# EAGLE design ocmod_module_playground_smt_v1 (EAGLE 7.3.0)
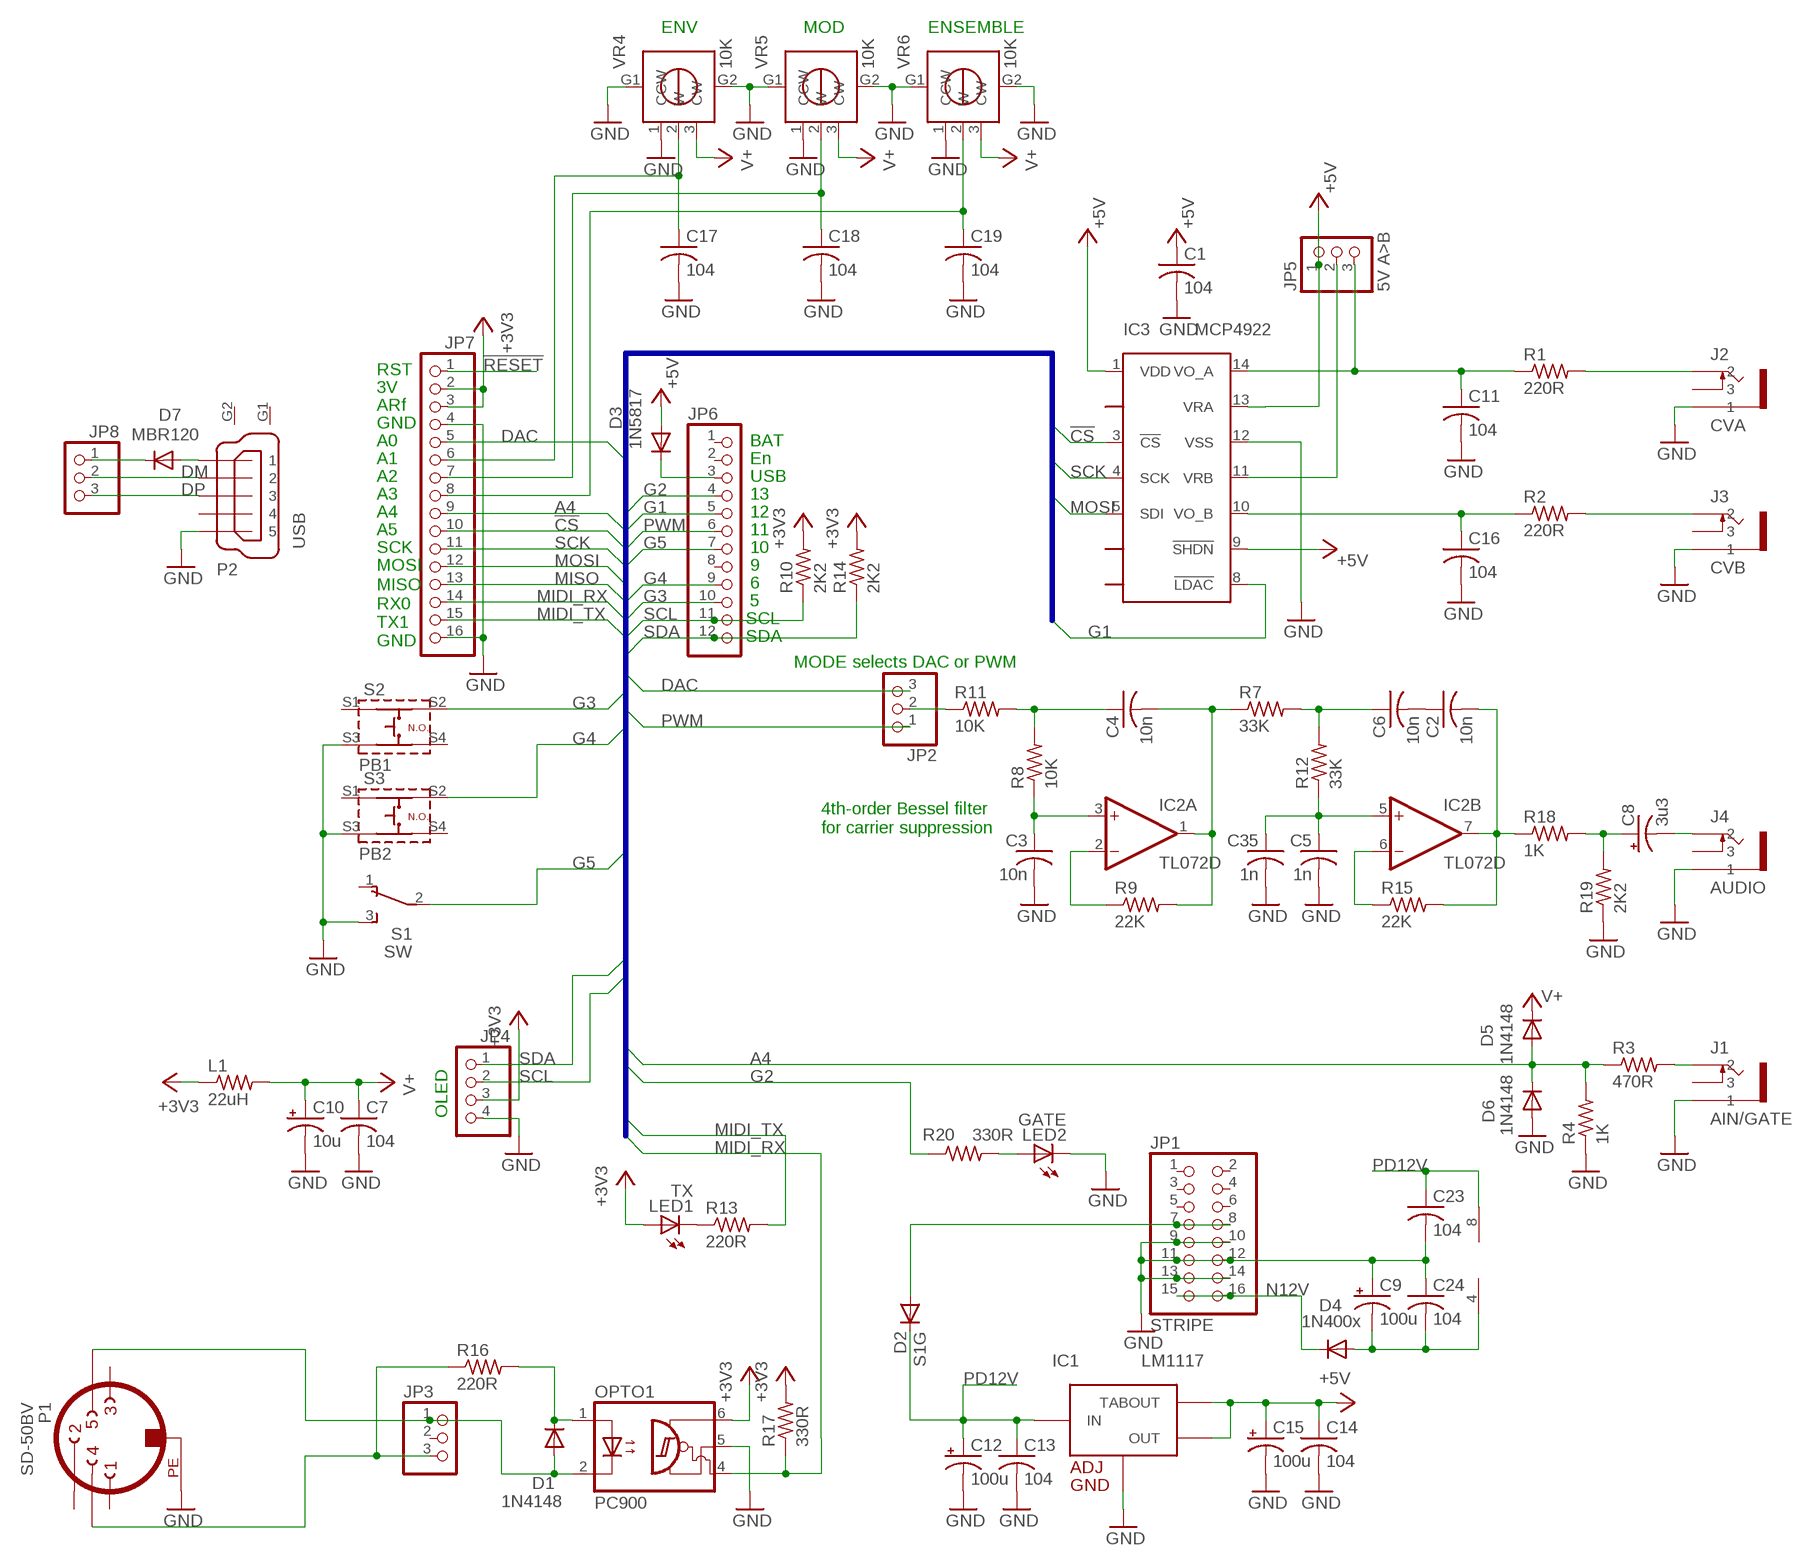
[diagram p0: schematic, sheet 1]

## Parts
C1  104  C-USC0805K  [C0805K]
C2  10n  C-USC0805K  [C0805K]
C3  10n  C-USC0805K  [C0805K]
C4  10n  C-USC0805K  [C0805K]
C5  1n  C-USC0805K  [C0805K]
C6  10n  C-USC0805K  [C0805K]
C7  104  C-USC0805K  [C0805K]
C8  3u3  CPOL-USB/3528-21R  [B/3528-21R]
C9  100u  CPOL-USB/3528-21R  [B/3528-21R]
C10  10u  CPOL-USB/3528-21R  [B/3528-21R]
C11  104  C-USC0805K  [C0805K]
C12  100u  CPOL-USB/3528-21R  [B/3528-21R]
C13  104  C-USC0805K  [C0805K]
C14  104  C-USC0805K  [C0805K]
C15  100u  CPOL-USB/3528-21R  [B/3528-21R]
C16  104  C-USC0805K  [C0805K]
C17  104  C-USC0805K  [C0805K]
C18  104  C-USC0805K  [C0805K]
C19  104  C-USC0805K  [C0805K]
C23  104  C-USC0805K  [C0805K]
C24  104  C-USC0805K  [C0805K]
C35  1n  C-USC0805K  [C0805K]
D1  1N4148  DIODE-SOD123  [SOD123]
D2  S1G  DIODE-DO-214AC  [DO-214AC]
D3  1N5817  DIODE-DO214AC  [DO214AC]
D4  1N400x  DIODE-DO-214AC  [DO-214AC]
D5  1N4148  DIODE-SOD123  [SOD123]
D6  1N4148  DIODE-SOD123  [SOD123]
D7  MBR120  DIODE-SOD123  [SOD123]
IC1  LM1117  [SOT223]
IC2  TL072D  [SO08]
IC3  MCP4922  MCP4922D  [SO14]
J1  AIN/GATE  WQP-PJ301M-12_JACK  [WQP-PJ301M-12_JACK]
J2  CVA  WQP-PJ301M-12_JACK  [WQP-PJ301M-12_JACK]
J3  CVB  WQP-PJ301M-12_JACK  [WQP-PJ301M-12_JACK]
J4  AUDIO  WQP-PJ301M-12_JACK  [WQP-PJ301M-12_JACK]
JP1  STRIPE  PINHD-2X8  [2X08]
JP2  PINHD-1X3  [1X03]
JP3  PINHD-1X3  [1X03]
JP4  PINHD-1X4  [1X04]
JP5  5V A>B  PINHD-1X3  [1X03]
JP6  PINHD-1X12  [1X12]
JP7  PINHD-1X16  [1X16]
JP8  PINHD-1X3  [1X03]
L1  22uH  R-US_R0805  [R0805]
LED1  TX  LED3MM  [LED3MM]
LED2  GATE  LED3MM  [LED3MM]
OPTO1  PC900  H11L1-MN  [DIL06N]
P1  SD-50BV  [SD-50BV_P]
P2  USB  MINI_USB5_WURTH  [MINI_USB5_WURTH]
R1  220R  R-US_R0805  [R0805]
R2  220R  R-US_R0805  [R0805]
R3  470R  R-US_R0805  [R0805]
R4  1K  R-US_R0805  [R0805]
R7  33K  R-US_R0805  [R0805]
R8  10K  R-US_R0805  [R0805]
R9  22K  R-US_R0805  [R0805]
R10  2K2  R-US_R0805  [R0805]
R11  10K  R-US_R0805  [R0805]
R12  33K  R-US_R0805  [R0805]
R13  220R  R-US_R0805  [R0805]
R14  2K2  R-US_R0805  [R0805]
R15  22K  R-US_R0805  [R0805]
R16  220R  R-US_R0805  [R0805]
R17  330R  R-US_R0805  [R0805]
R18  1K  R-US_R0805  [R0805]
R19  2K2  R-US_R0805  [R0805]
R20  330R  R-US_R0805  [R0805]
S1  SW  TL36PO  [TL3XPO]
S2  PB1  TACTSW_6MM  [TACTSW_6MM_P]
S3  PB2  TACTSW_6MM  [TACTSW_6MM_P]
VR4  10K  ALPHA_9MM_VERT  [ALPHA_9MM_VERT_P]
VR5  10K  ALPHA_9MM_VERT  [ALPHA_9MM_VERT_P]
VR6  10K  ALPHA_9MM_VERT  [ALPHA_9MM_VERT_P]

## Nets
!CS!: IC3.3(!CS) JP7.10
!RESET: JP7.1
+3V3: JP4.3 JP7.2 JP7.3 L1.1 LED1.A OPTO1.6(VCC) R10.2 R14.2 R17.2
+5V: C1.1 C14.1 C15.+ D3.A IC1.1(TABOUT) IC1.4(OUT) IC3.1(VDD) IC3.9(!SHDN!) IC3.13(VRA) JP5.1
A4: D5.A D6.C JP7.9 R3.1 R4.2
DAC: JP2.3 JP7.5
DM: JP8.2 P2.2
DP: JP8.3 P2.3
G1: IC3.8(!LDAC) JP6.5
G2: JP6.4 R20.1
G3: JP6.10 S2.S2
G4: JP6.9 S3.S2
G5: JP6.7 S1.2(P)
GND: C1.2 C3.2 C5.2 C7.2 C9.+ C10.- C11.2 C12.- C13.2 C14.2 C15.- C16.2 C17.2 C18.2 C19.2 C23.2 C24.1 C35.2 D6.A IC1.2(ADJ/GND) IC3.12(VSS) J1.P$3 J2.P$3 J3.P$3 J4.P$3 JP1.9 JP1.10 JP1.11 JP1.12 JP1.13 JP1.14 JP4.4 JP7.4 JP7.16 LED2.K(C) OPTO1.5(GND) P1.PE P2.5 R4.1 R19.1 S1.3(S) S2.S3 S3.S3 VR4.1(CCW) VR4.G1 VR4.G2 VR5.1(CCW) VR5.G1 VR5.G2 VR6.1(CCW) VR6.G1 VR6.G2
MIDI_RX: JP7.14 OPTO1.4(VO) R17.1
MIDI_TX: JP7.15 R13.2
MISO: JP7.13
MOSI: IC3.5(SDI) JP7.12
N12V: D4.C JP1.15 JP1.16
N$1: JP2.2 R11.1
N$2: D3.C JP6.3
N$3: C19.1 JP7.8 VR6.2(W)
N$4: J3.P$1 R2.2
N$5: C11.1 IC3.14(VO_A) JP5.3 R1.1
N$6: C9.- C24.2 D4.A IC2.4(P:V-)
N$7: IC2.2(A:-IN) R9.1
N$8: C4.2 IC2.1(A:OUT) R7.1 R9.2
N$9: C3.1 IC2.3(A:+IN) R8.1
N$10: C4.1 R8.2 R11.2
N$11: IC2.6(B:-IN) R15.1
N$12: C5.1 C35.1 IC2.5(B:+IN) R12.1
N$13: C6.1 R7.2 R12.2
N$14: C8.- J4.P$1
N$15: C2.1 C6.2
N$16: JP3.3 P1.4 R16.1
N$17: C2.2 IC2.7(B:OUT) R15.2 R18.1
N$18: LED2.A R20.2
N$19: C18.1 JP7.7 VR5.2(W)
N$20: C17.1 JP7.6 VR4.2(W)
N$21: D7.A P2.1
N$22: C16.1 IC3.10(VO_B) R2.1
N$23: C8.+ R18.2 R19.2
N$24: LED1.K(C) R13.1
N$25: J2.P$1 R1.2
N$26: J1.P$1 R3.2
N$27: D7.C JP8.1
N$29: IC3.11(VRB) JP5.2
N$42: D1.A JP3.1 OPTO1.2(C) P1.5
N$51: D1.C OPTO1.1(A) R16.2
P12V: D2.A JP1.7 JP1.8
PD12V: C12.+ C13.1 C23.1 D2.C IC1.3(IN) IC2.8(P:V+)
PWM: JP2.1 JP6.6
SCK: IC3.4(SCK) JP7.11
SCL: JP4.2 JP6.11 R10.1
SDA: JP4.1 JP6.12 R14.1
V+: C7.1 C10.+ D5.C L1.2 VR4.3(CW) VR5.3(CW) VR6.3(CW)
Unconnected: J1.P$2 J2.P$2 J3.P$2 J4.P$2 JP1.1 JP1.2 JP1.3 JP1.4 JP1.5 JP1.6 JP3.2 JP6.1 JP6.2 JP6.8 P1.1 P1.2 P1.3 P2.4 P2.G1 P2.G2 S1.1(O) S2.S1 S2.S4 S3.S1 S3.S4

## Buses
MIDI_RX,MIDI_TX,MOSI,MISO,SCK,G1,G2,G3,G4,G5,!CS!,SDA,SCL,DAC,PWM,A4

## Notes on the sheet
- ENV | MOD | ENSEMBLE
- RST
- 3V
- ARf
- GND
- A0 | BAT
- A1 | En
- A2 | USB
- A3 | 13
- A4 | 12
- A5 | 11
- SCK | 10
- MOSI | 9
- 6
- 5
- SCL
- SDA
- MISO
  RX0
  TX1
  GND
- MODE selects DAC or PWM
- 4th-order Bessel filter
  for carrier suppression
- OLED

## Library data of the parts
C1-C7 C11 C13 C14 C16-C19 C23 C24 C35 = rcl:C-US: CAPACITOR, American symbol
C8-C10 C12 C15 = rcl:CPOL-US: POLARIZED CAPACITOR, American symbol
D1-D7 = diode:DIODE-: DIODE
IC1 = s2m_thonk:LM1117
IC2 = linear:TL072: OP AMP
IC3 = s2m_thonk:MCP4922
J1-J4 = thonkiconn:WQP-PJ301M-12_JACK
JP1 = pinhead:PINHD-2X8: PIN HEADER
JP2 JP5 JP8 = adafruit:PINHD-1X3: PIN HEADER
JP3 = pinhead:PINHD-1X3: PIN HEADER
JP4 = pinhead:PINHD-1X4: PIN HEADER
JP6 = pinhead:PINHD-1X12: PIN HEADER
JP7 = pinhead:PINHD-1X16: PIN HEADER
L1 R1-R4 R7-R20 = rcl:R-US_: RESISTOR, American symbol
LED1 LED2 = led:LED: LED OSRAM: - CHIPLED LG R971, LG N971, LY N971, LG Q971, LY Q971, LO R971, LY R971 LH N974, LH R974 LS Q976, LO Q976, LY Q976 LO Q996 - Hyper CHIPLED LW Q18S LB Q993, LB Q99A, LB R99A - SideLED LS A670, LO A670, LY A670, LG A670, LP A670 LB A673, LV A673, LT A673, LW A673 LH A674 LY A675 LS A676, LA A676, LO A676, LY A676, LW A676 LS A679, LY A679, LG A679 - Hyper Micro SIDELED® LS Y876, LA Y876, LO Y876, LY Y876 LT Y87S - SmartLED LW L88C, LW L88S LB L89C, LB L89S, LG L890 LS L89K, LO L89K, LY L89K LS L896, LA L896, LO L896, LY L896 - TOPLED LS T670, LO T670, LY T670, LG T670, LP T670 LSG T670, LSP T670, LSY T670, LOP T670, LYG T670 LG T671, LOG T671, LSG T671 LB T673, LV T673, LT T673, LW T673 LH T674 LS T676, LA T676, LO T676, LY T676, LB T676, LH T676, LSB T676, LW T676 LB T67C, LV T67C, LT T67C, LS T67K, LO T67K, LY T67K, LW E67C LS E67B, LA E67B, LO E67B, LY E67B, LB E67C, LV E67C, LT E67C LW T67C LS T679, LY T679, LG T679 LS T770, LO T770, LY T770, LG T770, LP T770 LB T773, LV T773, LT T773, LW T773 LH T774 LS E675, LA E675, LY E675, LS T675 LS T776, LA T776, LO T776, LY T776, LB T776 LHGB T686 LT T68C, LB T68C - Hyper Mini TOPLED® LB M676 - Mini TOPLED Santana® LG M470 LS M47K, LO M47K, LY M47K Source: http://www.osram.convergy.de LUXEON: - LUMILED® LXK2-PW12-R00, LXK2-PW12-S00, LXK2-PW14-U00, LXK2-PW14-V00 LXK2-PM12-R00, LXK2-PM12-S00, LXK2-PM14-U00 LXK2-PE12-Q00, LXK2-PE12-R00, LXK2-PE12-S00, LXK2-PE14-T00, LXK2-PE14-U00 LXK2-PB12-K00, LXK2-PB12-L00, LXK2-PB12-M00, LXK2-PB14-N00, LXK2-PB14-P00, LXK2-PB14-Q00 LXK2-PR12-L00, LXK2-PR12-M00, LXK2-PR14-Q00, LXK2-PR14-R00 LXK2-PD12-Q00, LXK2-PD12-R00, LXK2-PD12-S00 LXK2-PH12-R00, LXK2-PH12-S00 LXK2-PL12-P00, LXK2-PL12-Q00, LXK2-PL12-R00 Source: www.luxeon.com KINGBRIGHT: KA-3528ASYC Source: www.kingbright.com
OPTO1 = s2m:H11L1-M
P1 = s2m_thonk:SD-50BV
P2 = s2m:MINI_USB5_WURTH
S1 = switch:TL36PO: TINY SWITCH ON - ON Source: http://www2.produktinfo.conrad.com/datenblaetter/700000-724999/705152-da-01-de-Subminiaturschalter_TL_36YO.pdf
S2 S3 = s2m_thonk:TACTSW_6MM
VR4-VR6 = s2m_511:ALPHA_9MM_VERT

## Board
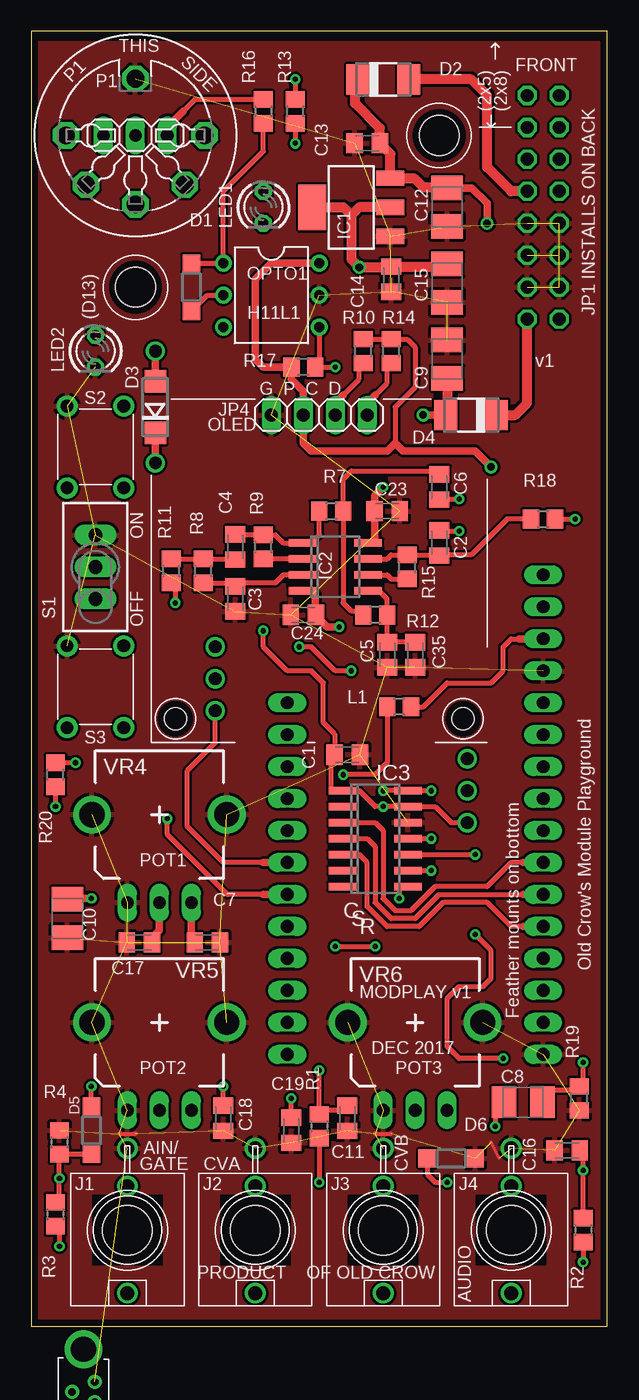
[diagram p1: board, top side]
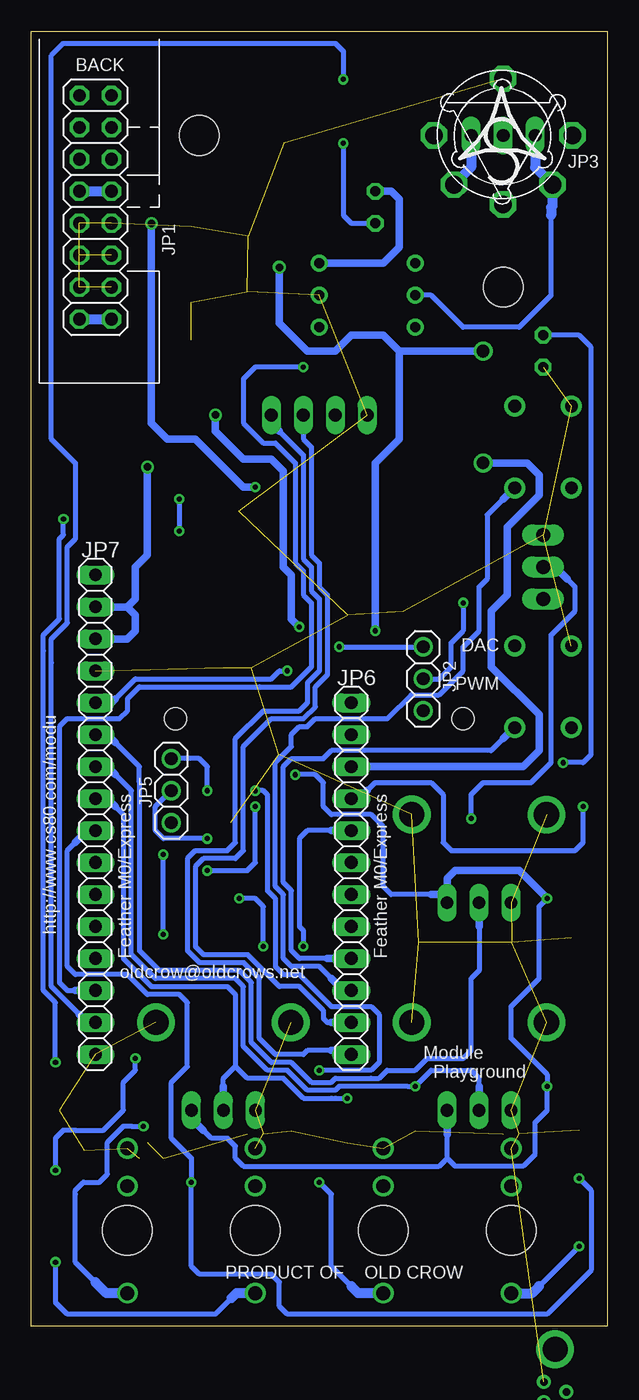
[diagram p2: board, bottom side, seen from below]

Size 45.72 x 102.87 mm. Coordinates in mm from the lower left corner, seen from the top.
Outline: 0,0 45.72,0 45.72,102.87 0,102.87 0,0
Copper layers (1*16): Top 0.035mm / dielectric 1.5mm / Bottom 0.035mm
Design rules "default *": minimum track width 10mil, minimum drill 16mil, track to track 8mil, track to pad 8mil, pad to pad 8mil, via to via 8mil, smd to smd 8mil, copper to edge 20mil, drill to drill 8mil, minimum pad ring 10mil, minimum via ring 8mil, stop-mask expansion 4mil, vias tented up to drill 0mil, thermal gap 10mil
Holes 3.17 mm at 8.26,82.55 32.38,94.61
Holes 1.78 mm at 11.43,48.26 34.29,48.26
Holes 3.96 mm at 17.78,7.62 7.62,7.62 38.1,7.62 27.94,7.62
tRestrict: area 28.3,39.7 to 28.6,40.3

### Footprints (pad centres in the part's own frame; a part is rotated, then mirrored left to right if it is on the bottom)
C0805K = smd 1.3 x 1.6: 1 -1,0; 2 1,0
B/3528-21R = smd 1.95 x 2.5: + 1.525,0; - -1.525,0
SOD123 = smd 1.4 x 1.4: A 1.9,0; C -1.9,0
DO-214AC = smd 1.8 x 2.4: A 2.025,0; C -2.025,0
DO214AC = smd 1.8 x 1.7: A 2.05,0; C -2.05,0
SOT223 = smd 3.6 x 2.2: 1 0,3.099 | smd 1.219 x 2.235: 2 -2.311,-3.099; 3 2.311,-3.099; 4 0,-3.099
SO08 = smd 0.6 x 2.2: 1 -1.905,-2.6; 2 -0.635,-2.6; 3 0.635,-2.6; 4 1.905,-2.6; 5 1.905,2.6; 6 0.635,2.6; 7 -0.635,2.6; 8 -1.905,2.6
SO14 = smd 0.6 x 2.2: 1 -3.81,-2.6; 2 -2.54,-2.6; 3 -1.27,-2.6; 4 0,-2.6; 5 1.27,-2.6; 6 2.54,-2.6; 7 3.81,-2.6; 8 3.81,2.6; 9 2.54,2.6; 10 1.27,2.6; 11 0,2.6; 12 -1.27,2.6; 13 -2.54,2.6; 14 -3.81,2.6
WQP-PJ301M-12_JACK = drill 1.1: P$1 0,5; P$2 0,-3.5; P$3 0,-6.5
2X08 = drill 1.016 octagon: 1 -8.89,-1.27; 2 -8.89,1.27; 3 -6.35,-1.27; 4 -6.35,1.27; 5 -3.81,-1.27; 6 -3.81,1.27; 7 -1.27,-1.27; 8 -1.27,1.27; 9 1.27,-1.27; 10 1.27,1.27; 11 3.81,-1.27; 12 3.81,1.27; 13 6.35,-1.27; 14 6.35,1.27; 15 8.89,-1.27; 16 8.89,1.27
1X03 = drill 1.016: 1 -2.54,0; 2 0,0; 3 2.54,0
1X03' = drill 1.016 long: 1 -2.54,0; 2 0,0; 3 2.54,0
1X04 = drill 1.016 long: 1 -3.81,0; 2 -1.27,0; 3 1.27,0; 4 3.81,0
1X12 = drill 1.016 long: 1 -13.97,0; 2 -11.43,0; 3 -8.89,0; 4 -6.35,0; 5 -3.81,0; 6 -1.27,0; 7 1.27,0; 8 3.81,0; 9 6.35,0; 10 8.89,0; 11 11.43,0; 12 13.97,0
1X16 = drill 1.016 long: 1 -19.05,0; 2 -16.51,0; 3 -13.97,0; 4 -11.43,0; 5 -8.89,0; 6 -6.35,0; 7 -3.81,0; 8 -1.27,0; 9 1.27,0; 10 3.81,0; 11 6.35,0; 12 8.89,0; 13 11.43,0; 14 13.97,0; 15 16.51,0; 16 19.05,0
R0805 = smd 1.3 x 1.5: 1 -0.95,0; 2 0.95,0
LED3MM = drill 0.813 octagon: A -1.27,0; K 1.27,0
DIL06N = drill 0.813: 1 -2.54,-3.81; 2 0,-3.81; 3 2.54,-3.81; 4 2.54,3.81; 5 0,3.81; 6 -2.54,3.81
SD-50BV_P = drill 1.4 octagon: 1 5.5,0; 2 0,-5.5; 3 -5.5,0; 4 3.918,-3.918; 5 -3.918,-3.918; PE 0,4.5
MINI_USB5_WURTH = drill 0.6: 1 0.9,-1.6; 2 -0.9,-0.8; 3 0.9,0; 4 -0.9,0.8; 5 0.9,1.6 | drill 2: G1 0,4.2; G2 0,-4.2
TL3XPO = drill 1.1 pad 1.422 long: 1 -2.54,0; 2 0,0; 3 2.54,0
TACTSW_6MM_P = drill 1 pad 1.676: S1 -3.25,2.25; S2 3.25,2.25; S3 -3.25,-2.25; S4 3.25,-2.25
ALPHA_9MM_VERT_P = drill 1 long: 1 -2.54,-6.985; 2 0,-6.985; 3 2.54,-6.985 | drill 2: G1 -5.353,0; G2 5.353,0.008

### Placement (x,y rotation side)
C1  25.08,45.4 0 top
C2  32.38,62.23 270 top
C3  16.19,57.78 270 top
C4  16.19,61.91 90 top
C5  28.26,53.34 270 top
C6  32.38,66.67 270 top
C7  13.97,30.48 0 top
C8  39.05,17.78 0 top
C9  33.02,76.83 90 top
C10  2.86,32.38 90 top
C11  25.08,16.51 270 top
C12  33.02,88.9 90 top
C13  26.67,93.98 180 top
C14  28.57,83.19 270 top
C15  33.02,82.87 90 top
C16  42.55,13.97 180 top
C17  8.57,30.48 180 top
C18  15.24,16.51 270 top
C19  20.64,15.56 270 top
C23  28.26,64.77 0 top
C24  21.59,56.52 0 top
C35  30.48,53.34 270 top
D1  12.7,82.55 270 top
D2  27.94,99.06 0 top
D3  9.84,73.03 90 top
D4  34.92,72.39 180 top
D5  4.76,15.56 270 top
D6  33.34,13.34 0 top
D7  2.86,-14.61 0 top  (outside the outline)
IC1  25.4,88.9 90 top
IC2  24.13,60.33 270 top
IC3  27.3,38.73 270 top
J1  7.62,7.62 180 top
J2  17.78,7.62 180 top
J3  27.94,7.62 180 top
J4  38.1,7.62 180 top
JP1  40.64,88.9 270 bottom
JP2  14.61,51.44 90 bottom
JP3  [1X03']  8.26,94.61 0 top
JP4  22.86,72.39 180 top
JP5  34.61,42.55 90 bottom
JP6  20.32,35.56 270 bottom
JP7  40.64,40.64 270 bottom
JP8  4.45,-20.95 0 top  (outside the outline)
L1  29.21,49.21 180 top
LED1  18.41,88.9 270 top
LED2  5.08,77.47 270 top
OPTO1  19.05,81.92 270 top
P1  8.26,94.61 0 top
P2  4.13,-6.03 0 top
R1  22.86,15.88 270 top
R2  43.81,7.62 270 top
R3  1.91,8.89 270 top
R4  2.22,14.61 270 top
R7  23.81,64.77 0 top
R8  13.65,60.01 90 top
R9  18.41,61.91 90 top
R10  26.35,77.47 90 top
R11  11.11,60.01 90 top
R12  27.3,56.52 180 top
R13  20.95,96.52 90 top
R14  28.57,77.47 90 top
R15  29.84,60.33 90 top
R16  18.41,96.52 270 top
R17  21.59,76.2 180 top
R18  40.64,64.14 0 top
R19  43.5,18.1 90 top
R20  1.91,43.81 90 top
S1  5.08,60.33 90 top
S2  5.08,69.85 270 top
S3  5.08,50.8 270 top
VR4  10.16,40.64 0 top
VR5  10.16,24.13 0 top
VR6  30.48,24.13 0 top

### Tracks (layer width: path | path; a pad name or v marks a point on that pad's centre or on a via)
!CS!
  Top 0.406: 39.05,36.83 38.1,36.83 36.2,34.92 32.07,34.92 30.16,33.02 28.89,33.02 27.94,33.97 27.94,39.37 27.3,40.01 IC3.3
  Top 0.61: JP7.10 39.05,36.83
+3V3  (via drill 0.6)
  Top 0.406: L1.1 31.11,49.21 31.75,49.85 33.02,51.12 36.51,51.12 37.47,52.07 37.47,53.98 38.1,54.61 38.73,54.61 | 28.89,70.17 28.89,73.03 30.48,74.61 30.48,77.79 29.85,78.42 R14.2 R10.2
  Top 0.61: OPTO1.6 19.05,84.45 17.78,83.19 17.78,76.83 18.41,76.2 R17.2 20.64,75.25 21.59,74.3 JP4.3 21.59,70.17 22.23,69.53 28.26,69.53 28.89,70.17 29.53,69.53 35.24,69.53 v36.51,68.26 | 38.73,54.61 JP7.3
  Bottom 0.61: LED1.A 17.14,90.17 16.51,89.53 16.51,85.72 17.78,84.45 OPTO1.6 | JP7.2 38.1,57.15 | 38.1,57.15 37.47,57.78 37.47,60.33 36.51,61.28 v36.51,68.26 | 38.1,57.15 37.47,56.52 37.47,55.24 38.1,54.61 JP7.3
+5V  (via drill 0.41, 0.6, 1)
  Top 0.406: 9.99,74.93 D3.A | IC3.9 v31.75,36.2 31.81,36.2 | v18.41,55.24 18.41,53.98 20.32,52.07 22.23,52.07 23.18,51.12 23.18,47.94 24.08,47.04 C1.1 23.81,44.81 23.81,42.55 IC3.1 26.04,42.55 27.3,41.27 v27.94,41.27 IC3.13 31.75,41.27 32.07,41.27 33.34,40.01 JP5.1
  Top 0.61: D3.A v9.84,77.47
  Top 0.813: IC1.1 24.77,88.9 25.4,88.27 | 25.4,88.27 25.4,84.77 v26.04,84.14 28.53,84.14 C14.1 32.81,84.19 C15.+ | IC1.4 26.04,88.9 25.4,88.27
  Bottom 0.406: 31.81,36.2 v31.75,36.2 28.57,36.2 27.94,36.83 v27.94,41.27
  Bottom 0.61: v26.04,84.14 26.04,79.69 23.81,77.47 21.59,77.47 20.32,78.74 17.78,78.74 16.51,77.47 | 16.51,77.47 16.51,70.48 18.41,68.58 v18.41,55.24 | v9.84,77.47 16.51,77.47
A4  (via drill 0.41)
  Top 0.406: D6.C 31.44,12.06 32.07,11.43 v33.02,11.43 | R3.1 2.22,9.84 v2.22,11.75 R4.2 D5.A
  Bottom 0.406: 42.23,38.42 42.86,37.78 42.86,28.57 42.23,27.94 38.1,27.94 36.51,26.35 33.97,26.35 33.34,25.72 33.34,20.64 34.61,19.37 34.61,14.92 33.02,13.34 v33.02,11.43 33.02,4.76 32.38,4.13 26.67,4.13 26.04,3.49 26.04,1.59 25.4,0.95 21.91,0.95 4.76,0.95 1.27,4.45 1.27,10.79 v2.22,11.75
  Bottom 0.61: 42.23,38.42 41.27,39.37 JP7.9
DAC  (via drill 0.41)
  Top 0.406: v25.4,52.07 24.13,52.07 22.23,53.98 v21.27,53.98
  Bottom 0.406: 39.05,49.85 37.47,51.44 26.67,51.44 26.04,52.07 v25.4,52.07 | v21.27,53.98 JP2.3
  Bottom 0.61: JP7.5 39.37,49.53 39.05,49.85
DM  (1 unrouted)
DP  (1 unrouted)
G1  (via drill 0.41)
  Top 0.406: v24.13,30.16 v27.3,30.16 | IC3.8 29.21,34.92 v29.21,33.97
  Bottom 0.406: 21.91,39.37 23.81,39.37 24.45,38.73 24.45,34.61 24.45,31.75 24.13,31.43 v24.13,30.16 | v27.3,30.16 27.3,33.34 27.94,33.97 v29.21,33.97
  Bottom 0.61: JP6.5 20.95,39.37 21.91,39.37
G2  (via drill 0.41)
  Top 0.406: R20.1 v1.91,41.27
  Bottom 0.406: 19.05,42.55 18.41,43.18 13.97,43.18 13.02,42.23 13.02,38.42 12.38,37.78 2.54,37.78 1.91,38.42 v1.91,41.27
  Bottom 0.61: JP6.4 19.68,41.91 19.05,42.55
G3
  Bottom 0.406: 8.26,65.72 9.53,64.45 9.53,59.37 10.16,58.74 10.16,55.24 11.43,53.98 11.43,52.07 13.34,50.16 15.56,50.16 17.46,48.26 23.18,48.26 23.81,47.62 24.45,47.62 25.08,46.99 25.08,46.04 26.35,44.77 26.35,34.92 25.72,34.29 25.72,29.21 25.08,28.57 22.86,28.57 21.91,27.62
  Bottom 0.61: S2.S2 7.38,66.6 8.26,65.72 | 21.91,27.62 20.95,26.67 JP6.10
G4
  Bottom 0.406: 8.26,46.67 9.21,45.72 21.91,45.72 22.54,45.09 25.08,45.09 25.72,44.45 25.72,35.24 25.08,34.61 25.08,29.84 24.45,29.21 22.23,29.21
  Bottom 0.61: JP6.9 22.23,29.21 | S3.S2 7.38,47.55 8.26,46.67
G5  (via drill 0.41)
  Top 0.406: 18.41,34.29 15.56,34.29 10.79,39.05 v10.79,40.32
  Top 0.61: JP6.7 18.41,34.29
  Bottom 0.406: v10.79,40.32 10.79,42.23 9.84,43.18 6.03,43.18 4.45,44.77 4.45,54.93 2.54,56.83 2.54,58.74 3.17,59.37
  Bottom 0.61: S1.2 4.13,60.33 3.17,59.37
GND  (54 unrouted)
  Top 0.254: 37.15,13.34 36.51,14.61
  Top 0.305: 27.3,15.29 28.57,15.29 | 6.99,15.29 8.26,15.29
  pour Top: 0.64,101.92 45.09,101.92 45.09,0.7 0.64,0.7
MIDI_RX  (via drill 0.41)
  Top 0.406: v24.13,76.2 R17.1 22.86,76.52 OPTO1.4
  Bottom 0.406: 42.23,26.67 42.86,26.67 43.5,27.3 43.5,28.57 43.5,47.62 42.86,48.26 38.73,48.26 38.1,48.9 38.1,49.85 37.15,50.8 27.62,50.8 25.08,50.8 24.45,51.44 23.5,52.39 23.5,57.47 24.13,58.1 24.13,60.01 24.77,60.64 24.77,68.58 26.35,70.17 27.3,70.17 28.89,71.75 28.89,75.25 27.94,76.2 v24.13,76.2
  Bottom 0.61: 42.23,26.67 41.59,26.67 JP7.14
MIDI_TX  (via drill 0.41)
  Top 0.406: v20.95,99.06 R13.2
  Bottom 0.406: 41.91,24.77 44.13,26.99 44.13,52.7 44.13,54.61 42.86,55.88 42.86,61.91 42.23,62.55 42.23,68.58 44.13,70.48 44.13,100.97 43.18,101.92 21.59,101.92 20.95,101.28 v20.95,99.06
  Bottom 0.61: 41.91,24.77 41.27,24.13 JP7.15
MOSI
  Top 0.406: IC3.5 26.04,37.47 26.67,36.83 26.67,33.34 28.26,31.75 30.8,31.75 32.7,33.66 36.2,33.66 38.1,31.75 39.05,31.75
  Top 0.61: JP7.12 39.05,31.75
N12V
  Top 0.813: D4.C 38.42,72.39 39.37,73.34 JP1.16
  Bottom 0.813: JP1.15 JP1.16
N$1  (via drill 0.41)
  Top 0.406: R11.1 11.43,59.06 11.43,59.05 v11.43,57.47
  Bottom 0.406: JP2.2 13.34,51.44 12.38,52.39 12.38,54.29 11.43,55.24 v11.43,57.47
N$2  (via drill 1)
  Top 0.61: D3.C v9.84,68.58
  Bottom 0.61: JP6.3 6.67,44.45 5.4,45.72 5.4,48.58 9.21,52.39 9.21,56.83 7.94,58.1 7.94,63.5 5.4,66.04 5.4,67.63 6.35,68.58 v9.84,68.58
N$3  (via drill 0.41)
  Top 0.406: C19.1 v20.64,18.1
  Bottom 0.406: 39.05,41.27 38.42,40.64 38.42,29.21 36.2,26.99 30.16,26.99 29.53,26.35 29.53,20.64 | 30.48,19.05 30.48,19.68 29.53,20.64 | 29.53,20.64 28.57,19.68 25.72,19.68 24.13,18.1 21.91,18.1 21.59,18.1 v20.64,18.1
  Bottom 0.61: VR6.2 30.48,19.05 | JP7.8 39.69,41.91 39.05,41.27
N$4  (via drill 0.41)
  Top 0.406: R2.2 v43.81,5.08
  Bottom 0.406: 29.84,2.22 31.11,0.95 42.86,0.95 43.81,1.91 v43.81,5.08
  Bottom 0.813: J3.P$1 29.45,2.62 29.84,2.22
N$5  (via drill 0.41)
  Top 0.406: v31.75,42.55 IC3.14 v27.94,42.55 | v22.86,20.32 R1.1 23.18,17.14 25.08,17.14 25.08,17.46 C11.1
  Bottom 0.406: v31.75,42.55 31.75,44.45 32.38,45.09 JP5.3 | v27.94,42.55 27.3,42.55 26.99,42.23 26.99,34.61 26.35,33.97 26.35,28.57 25.72,27.94 24.45,27.94 21.91,25.4 18.73,25.4 18.1,24.77 18.1,20.95 18.73,20.32 21.91,20.32 v22.86,20.32
N$6  (via drill 0.41, 0.6)
  Top 0.61: D4.A v31.11,72.39 | IC2.4 22.23,58.42 22.54,58.1 22.54,56.56 C24.2 22.59,56.47 23.5,55.56 v24.45,55.56
  Top 0.813: C9.- 33.02,72.51 D4.A
  Bottom 0.61: v31.11,72.39 31.11,71.12 28.89,68.9 26.67,68.9 25.72,67.94 25.72,60.64 25.72,60.33 25.08,59.69 25.08,56.2 v24.45,55.56
N$7
  Top 0.406: IC2.2 R9.1
N$8
  Top 0.406: R7.1 22.86,62.87 22.23,62.23 IC2.1 20,62.23 19.37,62.86 R9.2 18.36,62.91 C4.2
N$9
  Top 0.406: IC2.3 20,59.69 19.37,59.05 16.46,59.05 C3.1 15.92,59.06 R8.1
N$10
  Top 0.406: R11.2 R8.2 16.15,60.96 C4.1
N$11
  Top 0.406: IC2.6 28.26,59.69 28.57,59.37 R15.1
N$12
  Top 0.406: C35.1 C5.1 R12.1 28.25,57.79 27.62,58.42 IC2.5
N$13
  Top 0.406: R12.2 26.04,56.83 25.4,56.83 24.76,57.47 R7.2 24.76,67.31 25.4,67.94 32.12,67.94 C6.1
N$14  (via drill 0.41)
  Top 0.406: C8.- 37.15,17.78 36.83,17.46 v36.83,15.88
  Bottom 0.406: 40.64,3.49 42.23,5.08 42.23,10.48 42.23,10.79 41.59,11.43 40.32,11.43 39.69,12.06 39.69,14.61 38.42,15.88 37.78,15.88 v36.83,15.88
  Bottom 0.813: J4.P$1 39.77,2.62 40.64,3.49
N$15  (via drill 0.41)
  Top 0.406: C2.1 32.38,63.18 v33.97,63.18 | C6.2 32.38,65.72 v33.97,65.72
  Bottom 0.406: v33.97,65.72 v33.97,63.18
N$16
  Top 0.406: 12.06,96.52 13.02,97.47 R16.1
  Top 0.61: 12.06,96.52 10.79,95.25 JP3.3
  Bottom 0.813: JP3.3 10.79,92.08 P1.4
N$17
  Top 0.406: IC2.7 28.26,60.96 28.57,61.28 R15.2 32.34,61.27 C2.2 32.43,61.28 34.92,61.28 37.78,64.14 R18.1
N$18  (via drill 0.41)
  Top 0.406: R20.2 2.22,44.77 v3.49,44.77
  Bottom 0.406: LED2.A 2.22,78.74 1.27,77.79 1.27,45.4 R20.2 v3.49,44.77
N$19  (via drill 0.41)
  Top 0.406: C18.1 v15.24,19.05
  Bottom 0.406: 10.16,19.05 10.16,19.68 10.79,20.32 13.97,20.32 v15.24,19.05 15.88,19.05 21.27,19.05 21.59,18.73 23.81,18.73 25.4,20.32 26.99,20.32 28.89,22.23 28.89,26.99 29.53,27.62 35.88,27.62 37.78,29.53 37.78,42.55 39.05,43.81
  Bottom 0.61: VR5.2 10.16,19.05 | JP7.7 39.69,44.45 39.05,43.81
N$20
  Top 0.61: C17.1 9.84,30.48 9.84,31.11 10.16,31.43 VR4.2
  Bottom 0.406: 10.16,31.75 10.16,28.26 10.79,27.62 10.79,21.91 11.43,21.27 14.29,21.27 15.24,20.32 17.46,20.32 18.1,19.68 18.73,19.68 21.59,19.68 21.91,19.37 23.5,19.37 25.08,20.95 26.67,20.95 28.26,22.54 28.26,27.3 29.21,28.26 35.56,28.26 37.15,29.84 37.15,43.18 37.15,44.45 39.05,46.35
  Bottom 0.61: JP7.6 39.69,46.99 39.05,46.35 | VR4.2 10.16,31.75
N$21  (1 unrouted)
N$22  (via drill 0.41)
  Top 0.406: IC3.10 v35.24,37.47 | R2.1 v43.81,12.38 43.81,13.7 C16.1 | v37.47,21.27 33.97,21.27 33.02,22.23 33.02,26.04 33.97,26.99 35.88,26.99 36.51,27.62 36.51,29.84 v35.24,31.11
  Bottom 0.406: v37.47,21.27 37.47,20.32 38.42,19.37 38.42,17.14 40.01,15.56 42.23,15.56 43.18,15.56 43.81,14.92 v43.81,12.38 | v35.24,31.11 v35.24,37.47
N$23  (via drill 0.41)
  Top 0.406: R18.2 v43.18,64.14 | v43.81,20.95 43.81,19.37 R19.2 43.18,18.73 40.64,18.73 40.64,17.84 C8.+
  Bottom 0.406: v43.18,64.14 43.18,62.87 43.5,62.55 43.5,56.2 44.77,54.93 44.77,53.66 44.77,26.67 43.81,25.72 v43.81,20.95
N$24  (via drill 0.41)
  Top 0.406: R13.1 v20.95,93.98
  Bottom 0.406: v20.95,93.98 20.95,88.27 20.32,87.63 LED1.K
N$25  (via drill 0.41)
  Top 0.406: R1.2 v22.86,11.43
  Bottom 0.406: 20.32,3.17 21.91,4.76 21.91,10.48 v22.86,11.43
  Bottom 0.813: J2.P$1 19.77,2.62 20.32,3.17
N$26  (via drill 0.41)
  Top 0.406: R3.2 2.22,7.94 v2.22,6.35
  Bottom 0.406: 5.4,3.17 5.08,3.49 3.17,5.4 v2.22,6.35
  Bottom 0.813: J1.P$1 5.95,2.62 5.4,3.17
N$27  (1 unrouted)
N$29  (via drill 0.41)
  Top 0.406: IC3.11 v31.75,38.73
  Bottom 0.406: v31.75,38.73 35.24,38.73 35.88,39.37 35.88,41.27 JP5.2
N$42
  Top 0.406: D1.A 13.97,81.92 OPTO1.2
  Bottom 0.406: 4.45,88.27 4.45,81.92 6.99,79.38 11.43,79.38 13.97,81.92 OPTO1.2
  Bottom 0.813: JP3.1 5.71,92.08 P1.5 4.34,89.01 4.45,88.9 4.45,88.27
N$51
  Top 0.406: R16.2 18.41,93.34 15.24,90.17 OPTO1.1 D1.C
P12V
  Top 0.813: JP1.8 38.1,90.17 36.2,92.08 36.2,97.79 34.92,99.06 D2.A
  Bottom 0.813: JP1.7 JP1.8
PD12V  (via drill 0.41, 0.6)
  Top 0.61: C12.+ 34.99,90.42 36.2,89.22 v36.2,87.63 | IC2.8 27.3,62.23 27.26,62.28 C23.1 27.26,65.99 v27.94,66.67
  Top 0.813: C12.+ 32.96,90.49 31.11,90.49 30.39,91.21 IC1.3 28.5,93.15 C13.1 27.67,95.2 25.72,97.16 25.72,99.04 D2.C
  Bottom 0.61: v36.2,87.63 36.2,71.75 34.92,70.48 32.7,70.48 28.89,66.67 v27.94,66.67
PWM
  Top 0.406: 18.41,36.83 15.24,36.83 12.38,39.69 12.38,44.13 14.61,46.35 JP2.1
  Top 0.61: JP6.6 18.41,36.83
SCK
  Top 0.406: 39.05,34.29 32.38,34.29 30.48,32.38 28.57,32.38 27.3,33.66 27.3,38.1 26.67,38.73 IC3.4
  Top 0.61: JP7.11 39.05,34.29
SCL
  Top 0.406: 24.77,73.98 26.04,75.25 26.04,76.2 R10.1
  Top 0.61: JP4.2 24.13,73.34 24.77,73.98
  Bottom 0.406: JP4.2 24.13,70.48 23.5,69.85 23.5,61.28 22.86,60.64 22.86,58.74 22.23,58.1 22.23,51.75 23.18,50.8 23.18,49.21 24.13,48.26 26.67,48.26 28.89,46.04 28.89,37.78 29.53,37.15 32.07,37.15 32.7,36.51 32.7,30.16 32.07,29.53 28.57,29.53 26.04,26.99 24.45,26.99 22.54,25.08 22.54,24.45 22.23,24.13 21.91,24.13
  Bottom 0.61: 21.91,24.13 JP6.11
SDA
  Top 0.406: 27.3,73.98 28.26,74.93 28.26,76.2 R14.1
  Top 0.61: JP4.1 26.67,73.34 27.3,73.98
  Bottom 0.406: 26.04,71.12 24.13,69.22 24.13,60.96 23.5,60.33 23.5,58.42 22.86,57.78 22.86,52.07 23.81,51.12 23.81,49.53 24.45,48.9 27.3,48.9 29.53,46.67 29.53,38.42 30.16,37.78 32.7,37.78 33.34,37.15 33.34,29.84 32.38,28.89 28.89,28.89 27.62,27.62 27.62,22.86 26.35,21.59 24.13,21.59 23.81,21.91 21.91,21.91
  Bottom 0.61: JP4.1 26.67,71.75 26.04,71.12 | JP6.12 20.64,21.59 20.95,21.91 21.91,21.91
V+  (via drill 0.41)
  Top 0.406: D5.C v4.76,19.05 | L1.2 28.26,44.77 27.3,43.81 v24.77,43.81
  Top 0.61: C10.+ 3.11,33.91 3.17,33.97 v4.76,33.97 | C7.1 12.7,30.48 VR4.3
  Bottom 0.406: 13.97,34.29 17.14,34.29 17.78,34.92 17.78,39.69 18.73,40.64 21.91,40.64 22.54,41.27 22.54,43.18 23.18,43.81 v24.77,43.81 | 12.7,13.34 12.06,12.7 6.67,12.7 5.71,13.65 5.71,15.88 5.71,16.19 4.76,17.14 v4.76,19.05 4.76,20 7.62,22.86 7.62,25.4 5.4,27.62 5.4,33.34 v4.76,33.97 | 12.7,13.34 13.34,12.7 28.89,12.7 29.53,13.34 29.53,14.29 30.16,14.92 31.43,14.92 32.07,15.56 | 12.7,13.34 12.7,15.24
  Bottom 0.61: VR4.3 12.7,34.29 | 12.7,34.29 13.97,34.29 | v4.76,33.97 6.99,36.2 12.06,36.2 12.7,35.56 12.7,34.29 | VR5.3 12.7,15.24 | VR6.3 33.02,16.51 32.07,15.56

### Text on the board
tPlace: THIS | SIDE | FRONT | P1 | (2x5) | (2x8) | (D13) | H11L1 | JP1 INSTALLS ON BACK | v1 | G P C D | OLED | ON | OFF | POT1 | C | S | R | Old Crow's Module Playground | MODPLAY v1 | Feather mounts on bottom | DEC 2017 | POT2 | POT3 | CVB | AIN/ | GATE | CVA | PRODUCT OF OLD CROW | AUDIO
bPlace: BACK | DAC / / PWM | http://www.cs80.com/modu | Feather M0/Express | Feather M0/Express | oldcrow@oldcrows.net | Module / Playground | PRODUCT OF OLD CROW